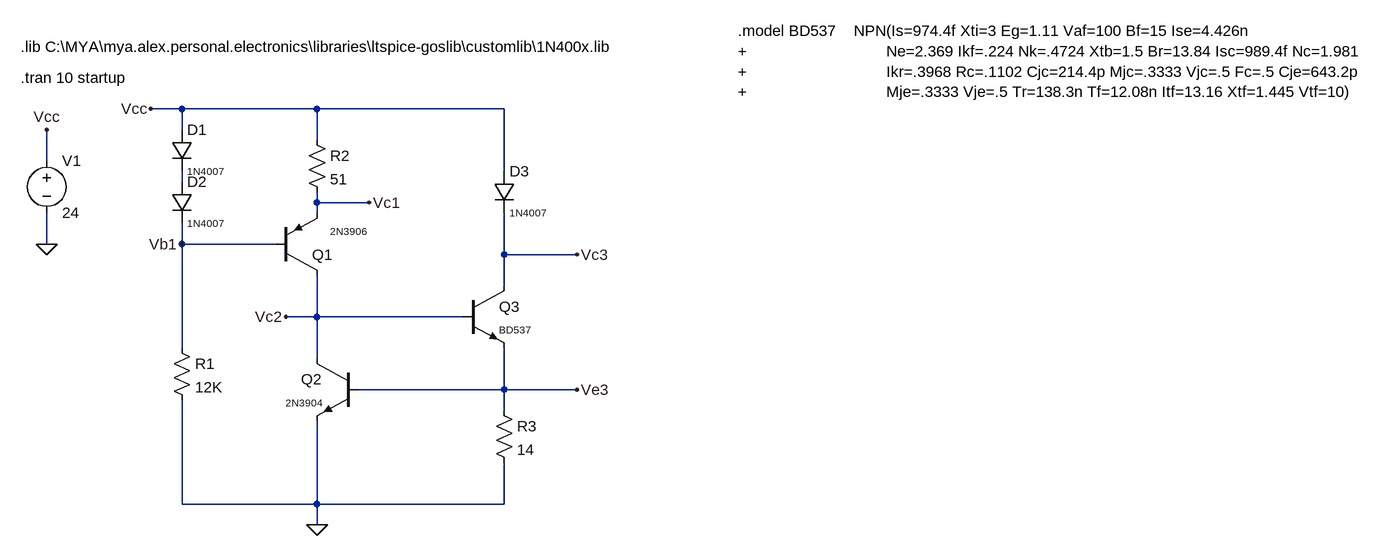
[diagram p0: schematic bjt-constant-current-generator.asc]
bjt-constant-current-generator.asc, the LTspice schematic file:
Version 4
SHEET 1 2644 740
WIRE -1856 -64 -1904 -64
WIRE -1648 -64 -1856 -64
WIRE -1360 -64 -1648 -64
WIRE -1856 -32 -1856 -64
WIRE -1648 -16 -1648 -64
WIRE -2064 16 -2064 -32
WIRE -1360 32 -1360 -64
WIRE -1856 48 -1856 32
WIRE -1648 80 -1648 64
WIRE -1568 80 -1648 80
WIRE -1648 96 -1648 80
WIRE -2064 144 -2064 96
WIRE -1856 144 -1856 112
WIRE -1712 144 -1856 144
WIRE -1360 160 -1360 96
WIRE -1248 160 -1360 160
WIRE -1360 208 -1360 160
WIRE -1648 256 -1648 192
WIRE -1648 256 -1696 256
WIRE -1424 256 -1648 256
WIRE -1856 304 -1856 144
WIRE -1648 320 -1648 256
WIRE -1360 368 -1360 304
WIRE -1360 368 -1584 368
WIRE -1248 368 -1360 368
WIRE -1360 400 -1360 368
WIRE -1856 544 -1856 384
WIRE -1648 544 -1648 416
WIRE -1648 544 -1856 544
WIRE -1360 544 -1360 480
WIRE -1360 544 -1648 544
WIRE -1648 576 -1648 544
FLAG -2064 144 0
FLAG -1856 144 Vb1
FLAG -2064 -32 Vcc
FLAG -1648 576 0
FLAG -1904 -64 Vcc
FLAG -1248 160 Vc3
FLAG -1248 368 Ve3
FLAG -1696 256 Vc2
FLAG -1568 80 Vc1
SYMBOL voltage -2064 0 R0
WINDOW 123 0 0 Left 0
WINDOW 39 0 0 Left 0
SYMATTR InstName V1
SYMATTR Value 24
SYMBOL pnp -1712 192 M180
WINDOW 3 84 68 Left 1
SYMATTR Value 2N3906
SYMATTR InstName Q1
SYMBOL res -1664 -32 R0
SYMATTR InstName R2
SYMATTR Value 51
SYMBOL res -1872 288 R0
SYMATTR InstName R1
SYMATTR Value 12K
SYMBOL diode -1872 48 R0
WINDOW 3 24 64 Left 1
SYMATTR Value 1N4007
SYMATTR InstName D2
SYMBOL diode -1872 -32 R0
WINDOW 3 24 64 Left 1
SYMATTR Value 1N4007
SYMATTR InstName D1
SYMBOL npn -1584 320 M0
WINDOW 3 56 68 Left 1
SYMATTR Value 2N3904
SYMATTR InstName Q2
SYMBOL npn -1424 208 R0
WINDOW 3 56 68 Left 1
SYMATTR Value BD537
SYMATTR InstName Q3
SYMBOL res -1376 384 R0
SYMATTR InstName R3
SYMATTR Value 14
SYMBOL diode -1376 32 R0
WINDOW 3 24 64 Left 1
SYMATTR Value 1N4007
SYMATTR InstName D3
TEXT -2104 -112 Left 2 !.tran 10 startup
TEXT -2104 -160 Left 2 !.lib C:\\MYA\\mya.alex.personal.electronics\\libraries\\ltspice-goslib\\customlib\\1N400x.lib
TEXT -1000 -184 Left 2 !.model BD537    NPN(Is=974.4f Xti=3 Eg=1.11 Vaf=100 Bf=15 Ise=4.426n\n+                               Ne=2.369 Ikf=.224 Nk=.4724 Xtb=1.5 Br=13.84 Isc=989.4f Nc=1.981\n+                               Ikr=.3968 Rc=.1102 Cjc=214.4p Mjc=.3333 Vjc=.5 Fc=.5 Cje=643.2p\n+                               Mje=.3333 Vje=.5 Tr=138.3n Tf=12.08n Itf=13.16 Xtf=1.445 Vtf=10)

The netlist it stands for:
* bjt-constant-current-generator.asc
V1 Vcc 0 24
Q1 Vc2 Vb1 Vc1 0 2N3906
R2 Vcc Vc1 51
R1 Vb1 0 12K
D2 N001 Vb1 1N4007
D1 Vcc N001 1N4007
Q2 Vc2 Ve3 0 0 2N3904
Q3 Vc3 Vc2 Ve3 0 BD537
R3 Ve3 0 14
D3 Vcc Vc3 1N4007
.model D D
.lib standard.dio
.model NPN NPN
.model PNP PNP
.lib standard.bjt
.tran 10 startup
.lib C:\MYA\mya.alex.personal.electronics\libraries\ltspice-goslib\customlib\1N400x.lib
.model BD537    NPN(Is=974.4f Xti=3 Eg=1.11 Vaf=100 Bf=15 Ise=4.426n
+                               Ne=2.369 Ikf=.224 Nk=.4724 Xtb=1.5 Br=13.84 Isc=989.4f Nc=1.981
+                               Ikr=.3968 Rc=.1102 Cjc=214.4p Mjc=.3333 Vjc=.5 Fc=.5 Cje=643.2p
+                               Mje=.3333 Vje=.5 Tr=138.3n Tf=12.08n Itf=13.16 Xtf=1.445 Vtf=10)
.backanno
.end